# Altium project digital_host_for_ADS1216.PrjPCB
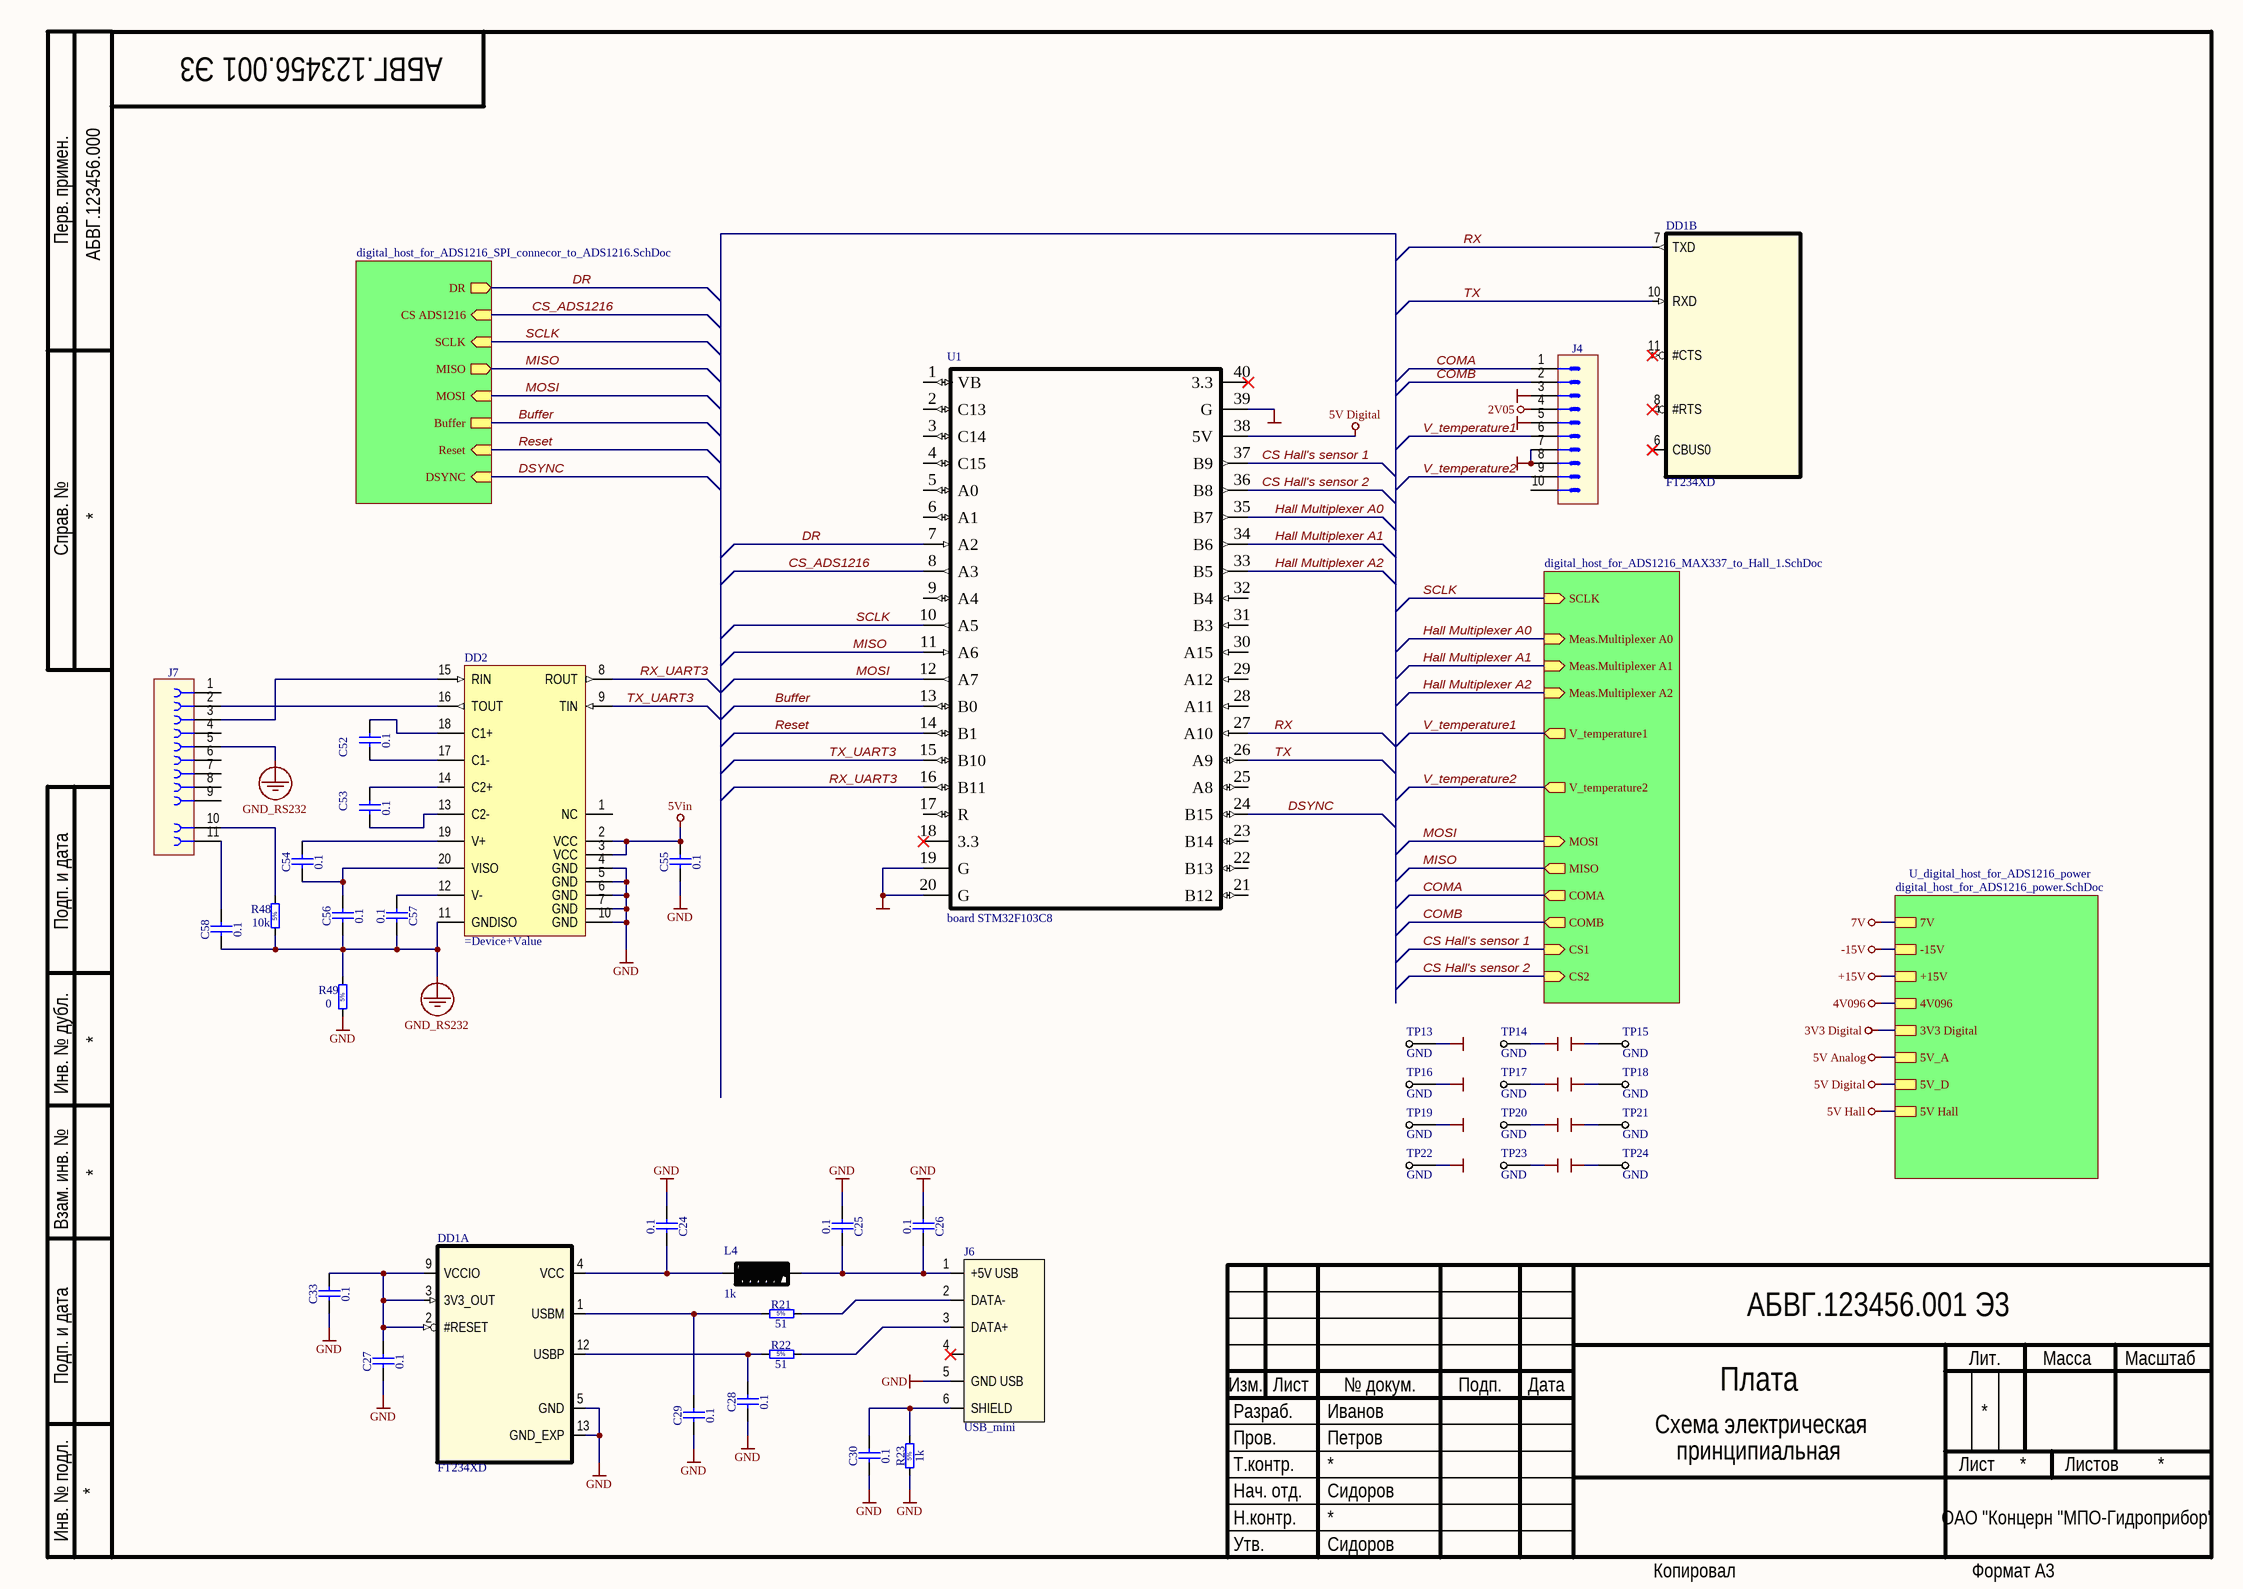
[diagram p0: digital_host_for_ADS1216_main.SchDoc]
3 sheets, 136 parts. Net scope: hierarchical (ports join the sheet entries above them; power ports are global).
Board file: mainboard3.PcbDoc
Sheets:
  digital_host_for_ADS1216_main.SchDoc
    connector to SPI ADS = digital_host_for_ADS1216_SPI_connecor_to_ADS1216.SchDoc
    U_digital_host_for_ADS1216_power = digital_host_for_ADS1216_power.SchDoc

## Sheet digital_host_for_ADS1216_main.SchDoc
size 420 x 297 mm; Address1: Address1; Address2: Address2; Address3: Address3; Address4: Address4; SheetNumber: 1; Scale: 1:1; Разраб.: Иванов; Обозначение документа: АБВГ.123456.001 Э3; Пров.: Петров; Утв.: Сидоров; Наименование организации: ОАО "Концерн "МПО-Гидроприбор"; Перв. применение: АБВГ.123456.000; Наименование изделия 1: Плата; Наименование изделия 2: Схема электрическая; Наименование изделия 3: принципиальная; Нач. отд.: Нач. отд.; Фамилия нач. отд.: Сидоров

### Parts
C24  0.1  [CAPC2012X90N]
C25  0.1  [CAPC2012X90N]
C26  0.1  [CAPC2012X90N]
C27  0.1  [CAPC2012X90N]
C28  0.1  [CAPC2012X90N]
C29  0.1  [CAPC2012X90N]
C30  0.1  [CAPC2012X90N]
C33  0.1  [CAPC2012X90N]
C52  0.1  [CAPC2012X90N]
C53  0.1  [CAPC2012X90N]
C54  0.1  [CAPC2012X90N]
C55  0.1  [CAPC2012X90N]
C56  0.1  [CAPC2012X90N]
C57  0.1  [CAPC2012X90N]
C58  0.1  [CAPC2012X90N]
DD1  FT234XD  [DFN_12-045]  (parts A,B of 2)
DD2  (no value)  [SOIC127P1032X265-20N]
J4  (no value)  [3M_N2510-6002RB]
J6  USB_mini  [TYCO_1734035-1]
J7  (no value)  [TYCO_5747844-5]
L4  1k  [RESC2012X50N]
R21  51  [RESC2012X70N]
R22  51  [RESC2012X70N]
R23  1k  [RESC2012X70N]
R48  10k  [RESC2012X70N]
R49  0  [RESC2012X70N]
TP13  GND  [TP1]
TP14  GND  [TP1]
TP15  GND  [TP1]
TP16  GND  [TP1]
TP17  GND  [TP1]
TP18  GND  [TP1]
TP19  GND  [TP1]
TP20  GND  [TP1]
TP21  GND  [TP1]
TP22  GND  [TP1]
TP23  GND  [TP1]
TP24  GND  [TP1]
U1  board STM32F103C8  [blue_pill]

### Sub-sheets
connector to SPI ADS = digital_host_for_ADS1216_SPI_connecor_to_ADS1216.SchDoc: DR (out), CS ADS1216 (in), SCLK (in), MISO (out), MOSI (in), Buffer, Reset (in), DSYNC (in)
multiplexer = digital_host_for_ADS1216_MAX337_to_Hall_1.SchDoc (file not in this document): Meas.Multiplexer A0 (in), Meas.Multiplexer A1 (in), Meas.Multiplexer A2 (in), COMA (out), COMB (out), V_temperature1 (out), V_temperature2 (out), MOSI (in), MISO (out), CS1 (in), CS2 (in), SCLK (in)
U_digital_host_for_ADS1216_power = digital_host_for_ADS1216_power.SchDoc: 7V, -15V, +15V, 4V096, 3V3 Digital, 5V_A, 5V_D, 5V Hall

### Nets
2V05: J4.4
5V Digital: U1.38(5V) ; sheet U_digital_host_for_ADS1216_power/5V_D
5Vin: C55.1 DD2.2(VCC) DD2.3(VCC)
GND: C24.1 C25.1 C26.1 C27.1 C28.1 C29.1 C30.1 C33.1 C55.2 DD1.5(GND) DD1.13(GND_EXP) DD2.4(GND) DD2.5(GND) DD2.6(GND) DD2.7(GND) DD2.10(GND) J4.3 J4.5 J4.7 J4.8 J6.5(GND_USB) R23.1 R49.1 TP13.1(P) TP14.1(P) TP15.1(P) TP16.1(P) TP17.1(P) TP18.1(P) TP19.1(P) TP20.1(P) TP21.1(P) TP22.1(P) TP23.1(P) TP24.1(P) U1.19(G) U1.20(G) U1.39(G)
GND_RS232: C56.2 C57.1 C58.2 DD2.11(GNDISO) J7.5 R48.1 R49.2
Buffer: U1.13(B0) ; sheet connector to SPI ADS/Buffer
COMA: J4.1 ; sheet multiplexer/COMA
COMB: J4.2 ; sheet multiplexer/COMB
CS Hall's sensor 1: U1.37(B9) ; sheet multiplexer/CS1
CS Hall's sensor 2: U1.36(B8) ; sheet multiplexer/CS2
CS_ADS1216: U1.8(A3) ; sheet connector to SPI ADS/CS ADS1216
DR: U1.7(A2) ; sheet connector to SPI ADS/DR
DSYNC: U1.24(B15) ; sheet connector to SPI ADS/DSYNC
Hall Multiplexer A0: U1.35(B7) ; sheet multiplexer/Meas.Multiplexer A0
Hall Multiplexer A1: U1.34(B6) ; sheet multiplexer/Meas.Multiplexer A1
Hall Multiplexer A2: U1.33(B5) ; sheet multiplexer/Meas.Multiplexer A2
MISO: U1.11(A6) ; sheet connector to SPI ADS/MISO, sheet multiplexer/MISO
MOSI: U1.12(A7) ; sheet connector to SPI ADS/MOSI, sheet multiplexer/MOSI
Reset: U1.14(B1) ; sheet connector to SPI ADS/Reset
RX: DD1.7(TXD) U1.27(A10)
RX_UART3: DD2.8(ROUT) U1.16(B11)
SCLK: U1.10(A5) ; sheet connector to SPI ADS/SCLK, sheet multiplexer/SCLK
TX: DD1.10(RXD) U1.26(A9)
TX_UART3: DD2.9(TIN) U1.15(B10)
V_temperature1: J4.6 ; sheet multiplexer/V_temperature1
V_temperature2: J4.9 ; sheet multiplexer/V_temperature2
NetC24_2: C24.2 DD1.4(VCC) L4.1
NetC25_2: C25.2 C26.2 J6.1(+5V_USB) L4.2
NetC27_2: C27.2 C33.2 DD1.2(#RESET) DD1.3(3V3_OUT) DD1.9(VCCIO)
NetC28_2: C28.2 DD1.12(USBP) R22.1
NetC29_2: C29.2 DD1.1(USBM) R21.1
NetC30_2: C30.2 J6.6(SHIELD) R23.2
NetC52_1: C52.1 DD2.18(C1+)
NetC52_2: C52.2 DD2.17(C1-)
NetC53_1: C53.1 DD2.14(C2+)
NetC53_2: C53.2 DD2.13(C2-)
NetC54_1: C54.1 DD2.19(V+)
NetC54_2: C54.2 C56.1 DD2.20(VISO)
NetC57_2: C57.2 DD2.12(V-)
NetC58_1: C58.1 J7.11
NetDD2_15: DD2.15(RIN) J7.3
NetDD2_16: DD2.16(TOUT) J7.2
NetJ6_2: J6.2(DATA-) R21.2
NetJ6_3: J6.3(DATA+) R22.2
NetJ7_10: J7.10 R48.2

Not connected (* = marked no-connect by the designer): DD1 6(CBUS0)* 8(#RTS)* 11(#CTS)*; DD2 1(NC); J4 10; J6 4*; J7 1 4 6 7 8 9; U1 1(VB) 2(C13) 3(C14) 4(C15) 5(A0) 6(A1) 9(A4) 17(R) 18(3.3)* 21(B12) 22(B13) 23(B14) 25(A8) 28(A11) 29(A12) 30(A15) 31(B3) 32(B4) 40(3.3)*

### Notes on the sheet
- Перв. примен.
- Справ. №
- Подп. и дата
- Инв. № дубл.
- Взам. инв. №
- Разраб.
- Изм.
- Лист
- № докум.
- Подп.
- Дата
- Лит.
- Масса
- Масштаб
- Пров.
- Т.контр.
- Листов
- Инв. № подл.
- Утв.
- Н.контр.
- Копировал
- Формат А3

### Library data of the parts
C24-C30 C33 C52-C58 = Capacitor - non polarized: Non-polarised capacitor2012; SolderOption: 0; SMD Solders: 2; Dielectric type: X5R; Vendor: any; Value: 0.1; THD Solders: 0
DD1 = FT234XD: USB-UART driver; Vendor: FTDI; SMD Solders: 7; THD Solders: 0; Device: FT234XD; Package: DFN_12-0.45; Unit Price: 2
DD2 = ADM3251: Driver UART-RS232; Vendor: Analog Devices; SMD Solder: 20; THD Solder: 0; Unit_Price: 1200; Device: ADM3251; Unit Price: 6; Package: SOICW20; SolderOption: 0
J4 = Connector 10 Male: THD Solders: 10; SMD Solders: 0; Solder Option: *; Value: *; Vendor: *
J6 = USB_mini: Вилка  PLS 6x2.54; Vendor: TE Connectivity; SolderOption: Norm; Price: 50; Value: USB_mini
J7 = Connector 9 Female: Solder Option: 0; THD Solders: 11; SMD Solders: 0; Vendor: *; Value: *
L4 = BLM21: SMD Ferrite bead 0805; Vendor: Vishay; Unit Price: 0.1; Device: BLM21; Package: SMD0805; Value: 1k
R21 R22 R48 = Resistor - 5%: Vendor: any; SMD Solders: 2; THD Solders: 0; TK: 100ppmC^(-1); SolderOption: 0; Tolerance: 5%
  R21 R22: Value: 51
  R48: Value: 10k
R23 = Resistor - 5%: Vendor: any; SMD Solders: 2; THD Solders: 0; TK: 1000ppmC^(-1); Value: 1k; SolderOption: 0; Tolerance: 5%
R49 = Resistor - 5%: Vendor: any; SMD Solders: 2; TK: 100ppmC^(-1); THD Solders: 0; Value: 0; SolderOption: 0; Tolerance: 5%
TP13-TP24 = TP: Контрольная точка; Vendor: PCB; Price: 0; Value: GND; SolderOption: PCB
U1 = Blue Pill: Blue Pill board; Vendor: STM; Pkg: DIP40; SMD Solders: 0; THD Solders: 40; Value: STM32; SolderOption: 0

## Sheet digital_host_for_ADS1216_SPI_connecor_to_ADS1216.SchDoc
size 420 x 297 mm; Address1: Address1; Address2: Address2; Address3: Address3; Address4: Address4; SheetNumber: 1; Scale: 1:1; Разраб.: Иванов; Обозначение документа: АБВГ.123456.001 Э3; Пров.: Петров; Утв.: Сидоров; Наименование организации: ОАО "Концерн "МПО-Гидроприбор"; Перв. применение: АБВГ.123456.000; Наименование изделия 1: Плата; Наименование изделия 2: Схема электрическая; Наименование изделия 3: принципиальная; Нач. отд.: Нач. отд.; Фамилия нач. отд.: Сидоров
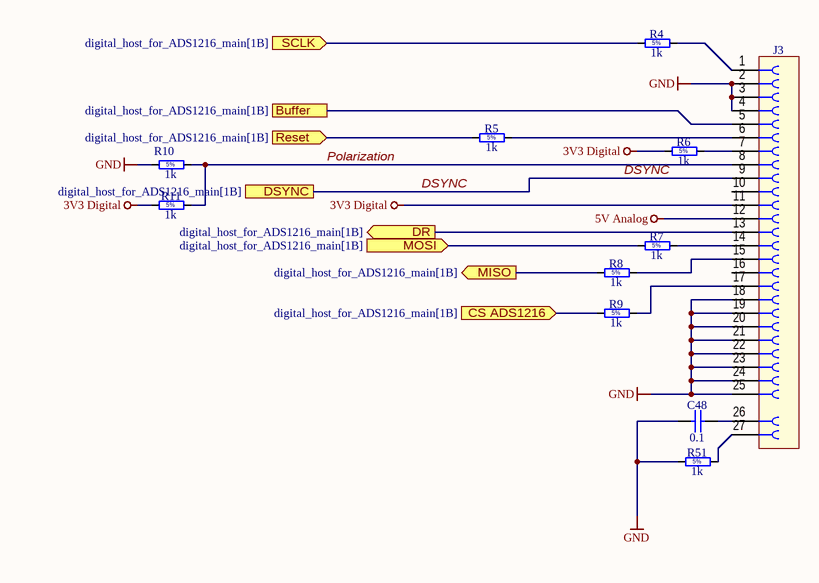
[diagram p1: digital_host_for_ADS1216_SPI_connecor_to_ADS1216.SchDoc]

### Parts
C48  0.1  [CAPC2012X90N]
J3  (no value)  [TYCO_3-1634586-2]
R4  1k  [RESC2012X70N]
R5  1k  [RESC2012X70N]
R6  1k  [RESC2012X70N]
R7  1k  [RESC2012X70N]
R8  1k  [RESC2012X70N]
R9  1k  [RESC2012X70N]
R10  1k  [RESC2012X70N]
R11  1k  [RESC2012X70N]
R51  1k  [RESC2012X70N]

### Ports
Buffer (see digital_host_for_ADS1216_main[1B]), CS ADS1216 (in, see digital_host_for_ADS1216_main[1B]), DR (out, see digital_host_for_ADS1216_main[1B]), DSYNC (see digital_host_for_ADS1216_main[1B]), MISO (out, see digital_host_for_ADS1216_main[1B]), MOSI (in, see digital_host_for_ADS1216_main[1B]), Reset (in, see digital_host_for_ADS1216_main[1B]), SCLK (in, see digital_host_for_ADS1216_main[1B])

### Nets
3V3 Digital: J3.11 R6.1 R11.2
5V Analog: J3.12
GND: C48.1 J3.2 J3.3 J3.4 J3.18 J3.19 J3.20 J3.21 J3.22 J3.23 J3.24 J3.25 R10.2 R51.1
Buffer: J3.5 ; port Buffer
CS_ADS1216: R9.1 ; port CS ADS1216
DR: J3.13 ; port DR
DSYNC: J3.9 ; port DSYNC
MISO: R8.1 ; port MISO
MOSI: R7.1 ; port MOSI
Polarization: J3.8 R10.1 R11.1
Reset: R5.1 ; port Reset
SCLK: R4.1 ; port SCLK
NetC48_2: C48.2 J3.26
NetJ3_1: J3.1 R4.2
NetJ3_6: J3.6 R5.2
NetJ3_7: J3.7 R6.2
NetJ3_14: J3.14 R7.2
NetJ3_15: J3.15 R8.2
NetJ3_17: J3.17 R9.2
NetJ3_27: J3.27 R51.2

Not connected (* = marked no-connect by the designer): J3 10 16

### Notes on the sheet
- Перв. примен.
- Справ. №
- Подп. и дата
- Инв. № дубл.
- Взам. инв. №
- Разраб.
- Изм.
- Лист
- № докум.
- Подп.
- Дата
- Лит.
- Масса
- Масштаб
- Пров.
- Т.контр.
- Листов
- Инв. № подл.
- Утв.
- Н.контр.
- Копировал
- Формат А3

### Library data of the parts
C48 = Capacitor - non polarized: as C24 on sheet digital_host_for_ADS1216_main; Value: 0.1; THD Solders: 0
J3 = Connector 25 Female: Solder Option: 0; THD Solders: 25; SMD Solders: 0; Vendor: *; Value: *
R4-R11 R51 = Resistor - 5%: as R23 on sheet digital_host_for_ADS1216_main; Value: 1k; SolderOption: 0; Tolerance: 5%

## Sheet digital_host_for_ADS1216_power.SchDoc
size 420 x 297 mm; Address1: Address1; Address2: Address2; Address3: Address3; Address4: Address4; SheetNumber: 1; Scale: 1:1; Разраб.: Иванов; Обозначение документа: АБВГ.123456.001 Э3; Пров.: Петров; Утв.: Сидоров; Наименование организации: ОАО "Концерн "МПО-Гидроприбор"; Перв. применение: АБВГ.123456.000; Наименование изделия 1: Плата; Наименование изделия 2: Схема электрическая; Наименование изделия 3: принципиальная; Нач. отд.: Нач. отд.; Фамилия нач. отд.: Сидоров
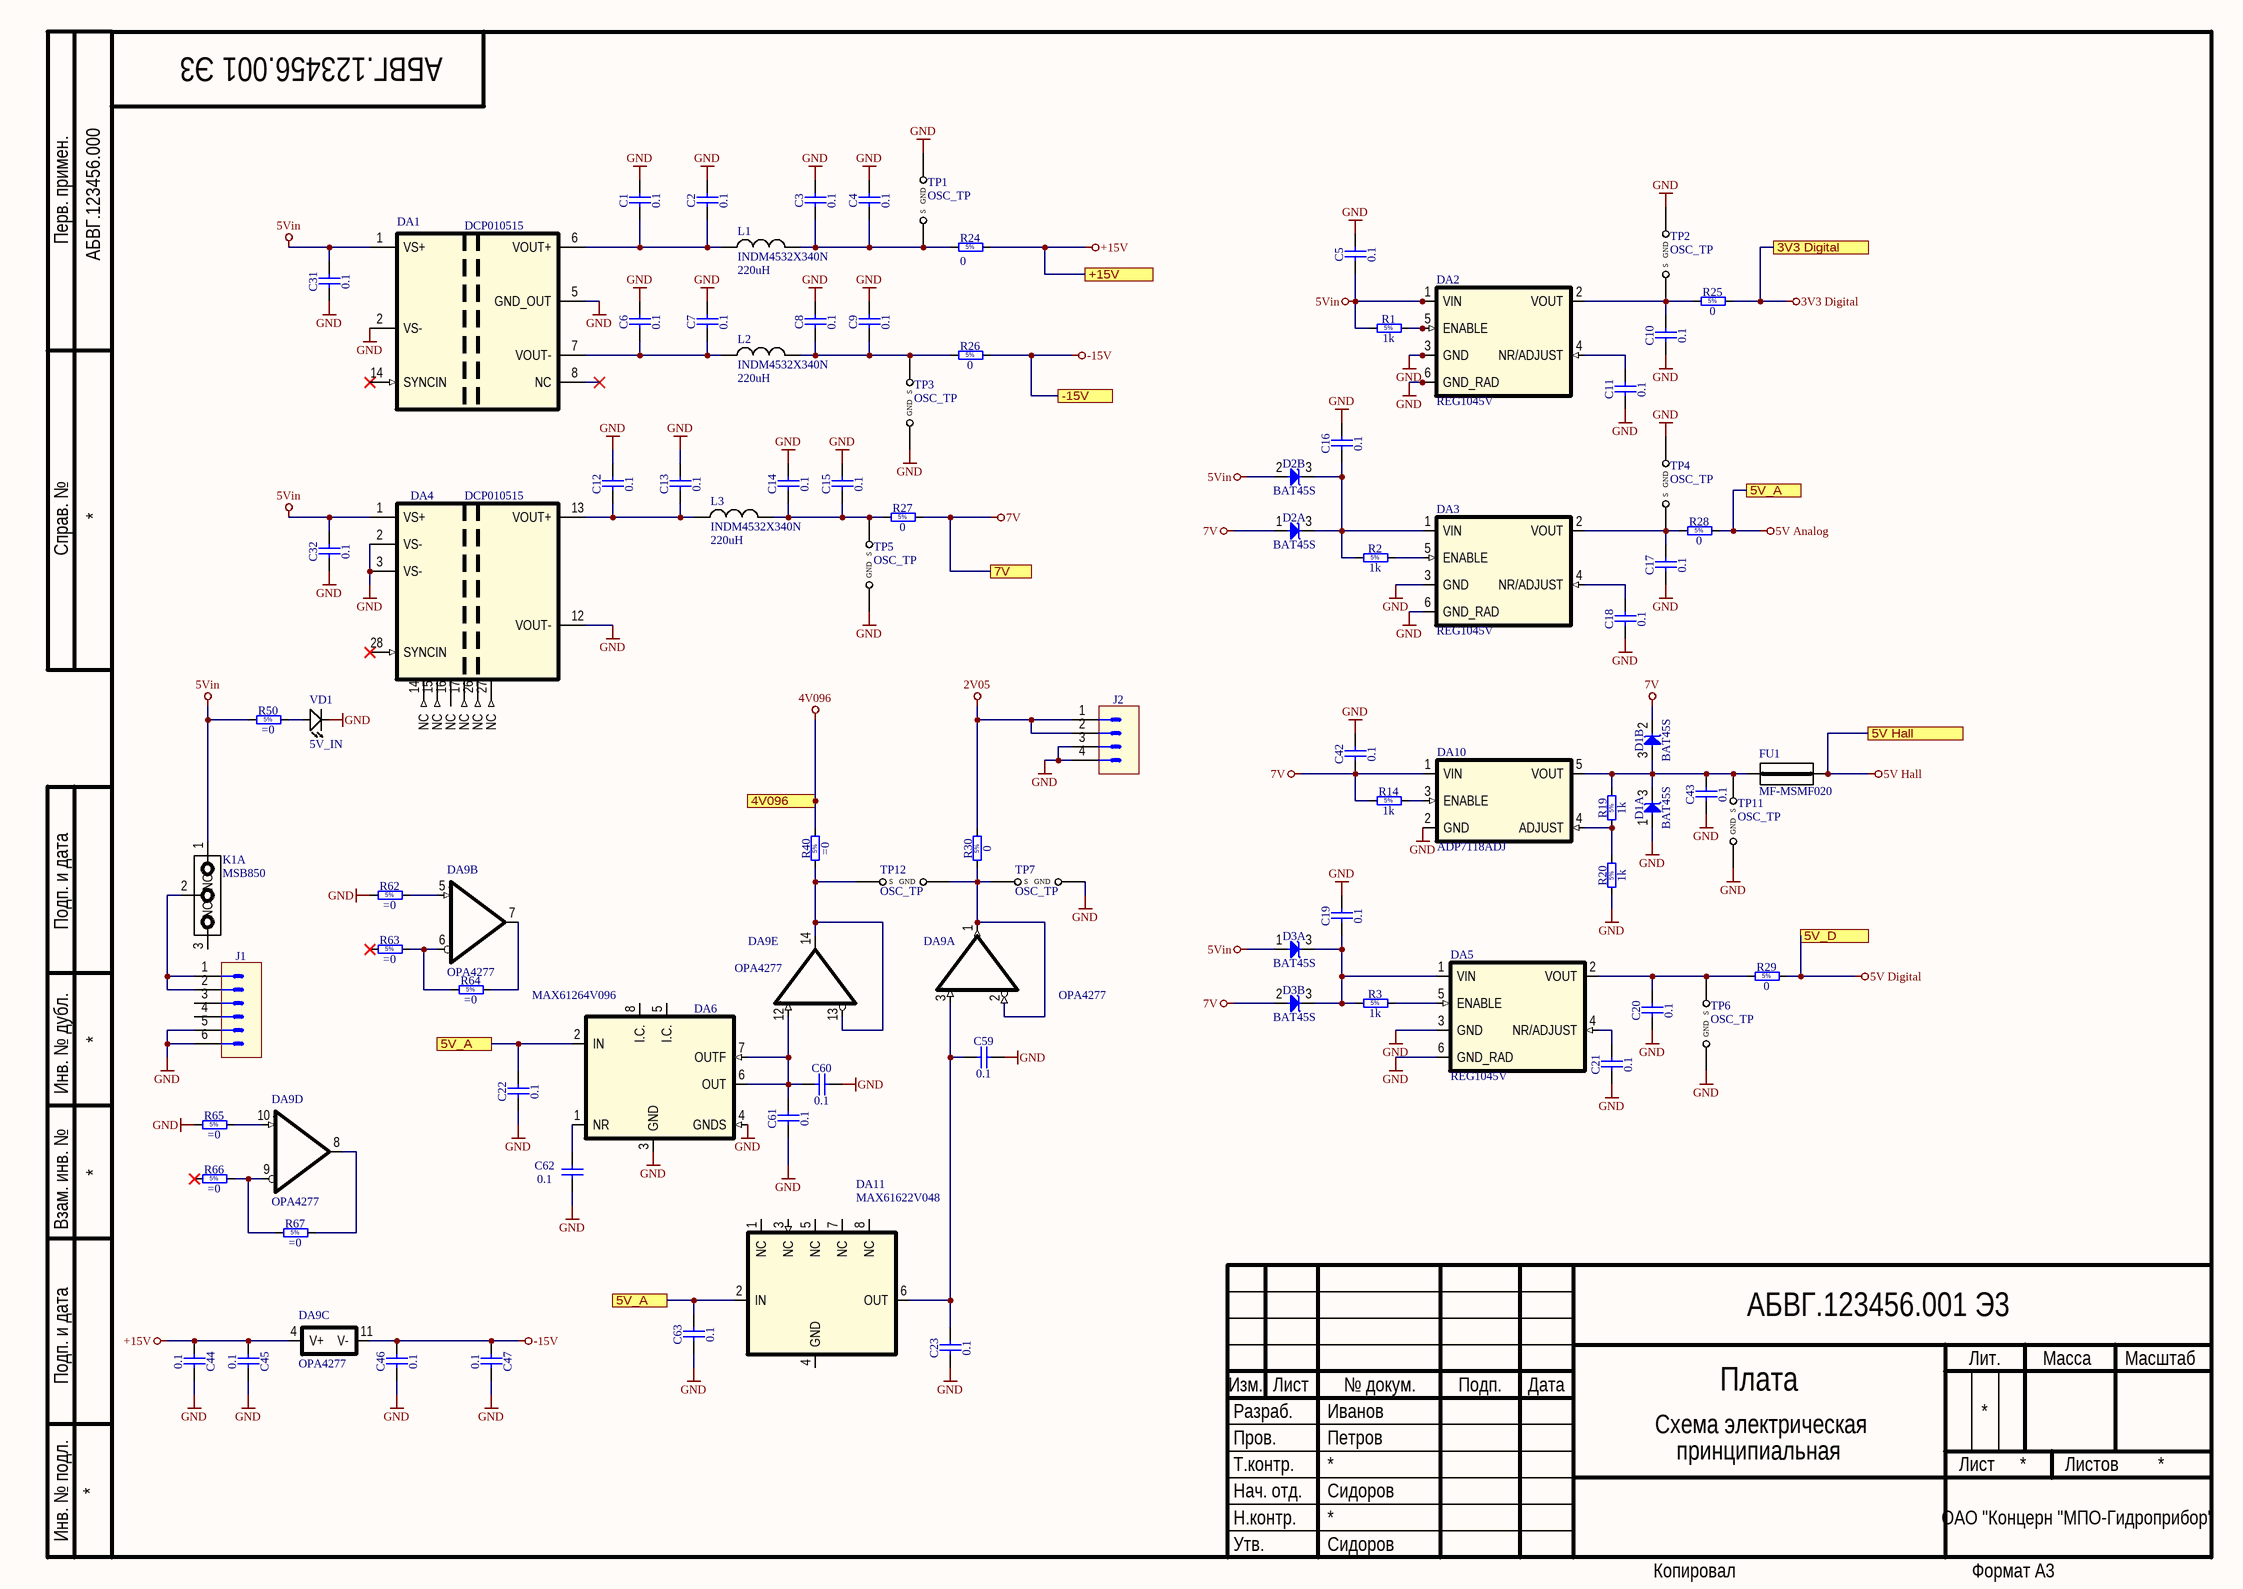
[diagram p2: digital_host_for_ADS1216_power.SchDoc]

### Parts
C1  0.1  [CAPC2012X90N]
C2  0.1  [CAPC2012X90N]
C3  0.1  [CAPC2012X90N]
C4  0.1  [CAPC2012X90N]
C5  0.1  [CAPC2012X90N]
C6  0.1  [CAPC2012X90N]
C7  0.1  [CAPC2012X90N]
C8  0.1  [CAPC2012X90N]
C9  0.1  [CAPC2012X90N]
C10  0.1  [CAPC2012X90N]
C11  0.1  [CAPC2012X90N]
C12  0.1  [CAPC2012X90N]
C13  0.1  [CAPC2012X90N]
C14  0.1  [CAPC2012X90N]
C15  0.1  [CAPC2012X90N]
C16  0.1  [CAPC2012X90N]
C17  0.1  [CAPC2012X90N]
C18  0.1  [CAPC2012X90N]
C19  0.1  [CAPC2012X90N]
C20  0.1  [CAPC2012X90N]
C21  0.1  [CAPC2012X90N]
C22  0.1  [CAPC2012X90N]
C23  0.1  [CAPC2012X90N]
C31  0.1  [CAPC2012X90N]
C32  0.1  [CAPC2012X90N]
C42  0.1  [CAPC2012X90N]
C43  0.1  [CAPC2012X90N]
C44  0.1  [CAPC2012X90N]
C45  0.1  [CAPC2012X90N]
C46  0.1  [CAPC2012X90N]
C47  0.1  [CAPC2012X90N]
C59  0.1  [CAPC2012X90N]
C60  0.1  [CAPC2012X90N]
C61  0.1  [CAPC2012X90N]
C62  0.1  [CAPC2012X90N]
C63  0.1  [CAPC2012X90N]
D1  BAT45S  [SOT-23]  (parts A,B of 2)
D2  BAT45S  [SOT-23]  (parts A,B of 2)
D3  BAT45S  [SOT-23]  (parts A,B of 2)
DA1  DCP010515  [NVA7]
DA2  REG1045V  [SOT223_6-127]
DA3  REG1045V  [SOT223_6-127]
DA4  DCP010515  [SOIC127P1033X265-12_28N]
DA5  REG1045V  [SOT223_6-127]
DA6  MAX61264V096  [SO8]
DA9  OPA4277  [SOIC14]  (parts A,B,C,D,E of 5)
DA10  ADP7118ADJ  [SOT95P270X145-5N]
DA11  MAX61622V048  [SO8]
FU1  MF-MSMF020  [MSMF020]
J1  (no value)  [MOLEX_22-27-2061]
J2  (no value)  [MOLEX_22-27-2041]
K1  MSB850  [MSB850]  (part A of 2)
L1  INDM4532X340N  Inductance: 220uH  [INDM4532X340N]
L2  INDM4532X340N  Inductance: 220uH  [INDM4532X340N]
L3  INDM4532X340N  Inductance: 220uH  [INDM4532X340N]
R1  1k  [RESC2012X70N]
R2  1k  [RESC2012X70N]
R3  1k  [RESC2012X70N]
R14  1k  [RESC2012X70N]
R19  1k  [RESC2012X70N]
R20  1k  [RESC2012X70N]
R24  0  [RESC2012X70N]
R25  0  [RESC2012X70N]
R26  0  [RESC2012X70N]
R27  0  [RESC2012X70N]
R28  0  [RESC2012X70N]
R29  0  [RESC2012X70N]
R30  0  [RESC2012X70N]
R40  (no value)  [RESC2012X70N]
R50  (no value)  [RESC2012X70N]
R62  (no value)  [RESC2012X70N]
R63  (no value)  [RESC2012X70N]
R64  (no value)  [RESC2012X70N]
R65  (no value)  [RESC2012X70N]
R66  (no value)  [RESC2012X70N]
R67  (no value)  [RESC2012X70N]
TP1  OSC_TP  [TP2]
TP2  OSC_TP  [TP2]
TP3  OSC_TP  [TP2]
TP4  OSC_TP  [TP2]
TP5  OSC_TP  [TP2]
TP6  OSC_TP  [TP2]
TP7  OSC_TP  [TP2]
TP11  OSC_TP  [TP2]
TP12  OSC_TP  [TP2]
VD1  5V_IN  [LED0603]

### Ports
3V3 Digital, 4V096, 5V Hall, 5V_A, 5V_D, 7V, +15V, -15V

### Nets
2V05: J2.1 J2.2 R30.2
3V3 Digital: R25.2 ; port 3V3 Digital
4V096: R40.2 ; port 4V096
5V Analog: C22.2 C63.2 DA6.2(IN) DA11.2(IN) R28.2 ; port 5V_A
5V Digital: R29.2 ; port 5V_D
5V Hall: FU1.2 ; port 5V Hall
5Vin: C5.1 C31.2 C32.2 D2.2(A) D3.1(A) DA1.1(VS+) DA2.1(VIN) DA4.1(VS+) K1.1(NO) R1.1 R50.2
7V: C42.1 D1.2(COMAC) D2.1(A) D3.2(A) DA10.1(VIN) R14.1 R27.2 ; port 7V
+15V: C44.1 C45.1 DA9.4(V+) R24.2 ; port +15V
-15V: C46.2 C47.1 DA9.11(V-) R26.2 ; port -15V
GND: C1.2 C2.2 C3.2 C4.2 C5.2 C6.2 C7.2 C8.2 C9.2 C10.1 C11.1 C12.2 C13.2 C14.2 C15.2 C16.2 C17.1 C18.1 C19.2 C20.1 C21.1 C22.1 C23.1 C31.1 C32.1 C42.2 C43.1 C44.2 C45.2 C46.1 C47.2 C59.2 C60.2 C61.1 C62.1 C63.1 D1.1(A) DA1.2(VS-) DA1.5(GND_OUT) DA2.3(GND) DA2.6(GND_RAD) DA3.3(GND) DA3.6(GND_RAD) DA4.2(VS-) DA4.3(VS-) DA4.12(VOUT-) DA5.3(GND) DA5.6(GND_RAD) DA6.3(GND) DA6.4(GNDS) DA10.2(GND) J1.5 J1.6 J2.3 J2.4 R20.1 R62.1 R65.1 TP1.2(GND) TP2.2(GND) TP3.2(GND) TP4.2(GND) TP5.2(GND) TP6.2(GND) TP7.2(GND) TP11.2(GND) VD1.1(Cathode)
NetC1_1: C1.1 C2.1 DA1.6(VOUT+) L1.1
NetC3_1: C3.1 C4.1 L1.2 R24.1 TP1.1(S)
NetC6_1: C6.1 C7.1 DA1.7(VOUT-) L2.1
NetC8_1: C8.1 C9.1 L2.2 R26.1 TP3.1(S)
NetC10_2: C10.2 DA2.2(VOUT) R25.1 TP2.1(S)
NetC11_2: C11.2 DA2.4(NR/ADJUST)
NetC12_1: C12.1 C13.1 DA4.13(VOUT+) L3.1
NetC14_1: C14.1 C15.1 L3.2 R27.1 TP5.1(S)
NetC16_1: C16.1 D2.3(COMAC) DA3.1(VIN) R2.1
NetC17_2: C17.2 DA3.2(VOUT) R28.1 TP4.1(S)
NetC18_2: C18.2 DA3.4(NR/ADJUST)
NetC19_1: C19.1 D3.3(COMAC) DA5.1(VIN) R3.1
NetC20_2: C20.2 DA5.2(VOUT) R29.1 TP6.1(S)
NetC21_2: C21.2 DA5.4(NR/ADJUST)
NetC23_2: C23.2 C59.1 DA9.3(+) DA11.6(OUT)
NetC43_2: C43.2 D1.3(COMAC) DA10.5(VOUT) FU1.1 R19.2 TP11.1(S)
NetC60_1: C60.1 C61.2 DA6.6(OUT) DA6.7(OUTF) DA9.12(+)
NetC62_2: C62.2 DA6.1(NR)
NetDA2_5: DA2.5(ENABLE) R1.2
NetDA3_5: DA3.5(ENABLE) R2.2
NetDA5_5: DA5.5(ENABLE) R3.2
NetDA9_1: DA9.1(OUT) DA9.2(-) R30.1 TP7.1(S) TP12.2(GND)
NetDA9_5: DA9.5(+) R62.2
NetDA9_6: DA9.6(-) R63.2 R64.1
NetDA9_7: DA9.7(OUT) R64.2
NetDA9_8: DA9.8(OUT) R67.2
NetDA9_9: DA9.9(-) R66.2 R67.1
NetDA9_10: DA9.10(+) R65.2
NetDA9_13: DA9.13(-) DA9.14(OUT) R40.1 TP12.1(S)
NetDA10_3: DA10.3(ENABLE) R14.2
NetDA10_4: DA10.4(ADJUST) R19.1 R20.2
NetJ1_1: J1.1 J1.2 K1.2(Cetnter)
NetR50_1: R50.1 VD1.2(Anode)

Not connected (* = marked no-connect by the designer): DA1 8(NC)* 14(SYNCIN)*; DA4 14(NC) 15(NC) 16(NC) 17(NC) 26(NC) 27(NC) 28(SYNCIN)*; DA6 5(I.C.) 8(I.C.); DA11 1(NC) 3(NC) 4(GND) 5(NC) 7(NC) 8(NC); J1 3 4; K1 3(NC); R63 1*; R66 1*

### Notes on the sheet
- Перв. примен.
- Справ. №
- Подп. и дата
- Инв. № дубл.
- Взам. инв. №
- Разраб.
- Изм.
- Лист
- № докум.
- Подп.
- Дата
- Лит.
- Масса
- Масштаб
- Пров.
- Т.контр.
- Листов
- Инв. № подл.
- Утв.
- Н.контр.
- Копировал
- Формат А3

### Library data of the parts
C1-C23 C31 C32 C42-C47 C59-C63 = Capacitor - non polarized: as C24 on sheet digital_host_for_ADS1216_main; Value: 0.1; THD Solders: 0
D1 = BAT54S: Serial Shottky Diode; SMD Solders: 3; THD Sollders: 0; Vendor: NXP; Unut Price: 10; Device: BAT45S; Package: SOT23
D2 D3 = BAT54C: Common Cathode 2 Shottky Diode; SMD Solders: 3; THD Sollders: 0; Vendor: NXP; Unut Price: 10; Device: BAT45S; Package: SOT23
DA1 = DCP020515: DC/DC 5V to isolated +-15V; Vendor: Texas Instruments; Copyright: Copyright (C) 2022 Ultra Librarian. All rights reserved.; Value: DCP010515; Price: 1000
DA2 = REG104_5V: Positive LDO Linear stabilizer 5Vin to 3V3Digital; Vendor: Texas Instruments; Device: REG104; Value: 5V; SMD Solder: 6; THD Solder: 0; Unit Price: 6; Package: SOT223-6; SolderOption: 0
DA3 = REG104_5V: Positive LDO Linear stabilizer 7V to 5V Analog; Vendor: Texas Instruments; Device: REG104; SMD Solder: 6; THD Solder: 0; Unit Price: 6; Package: SOT223-6; Value: 5V; SolderOption: 0
DA4 = DCP020507U: DC/DC 5V to isolated +-7V; Vendor: Texas Instruments; Copyright: Copyright (C) 2022 Ultra Librarian. All rights reserved.; Value: DCP010515; Price: 1000
DA5 = REG104_5V: Positive LDO Linear stabilizer 7V to 5V Digital; Vendor: Texas Instruments; Device: REG104; SMD Solder: 6; THD Solder: 0; Unit Price: 6; Package: SOT223-6; Value: 5V; SolderOption: 0
DA6 = MAX6126: Positive LDO Linear stabilizer; Vendor: Maxim; Value: 4V096; SMD Solder: 8; THD Solder: 0; Device: MAX6126; Unit Price: 2000; Package: SOIC_8; SolderOption: 0
DA9 = OPA4277: счетверённый ОУ; Vendor: Texas Instruments; Voltage: 3..30V/+-1.5..+-15V; Bandwidth: 1.3MHz; SolderOption: Norm; Value: OPA4277
DA10 = ADP7118: Positive LDO Linear stabilizer; Vendor: Analog Devoces; Value: ADJ; SMD Solder: 5; THD Solder: 0; Device: ADP7118; Unit Price: 100; Package: SOT23-5; SolderOption: 0
DA11 = MAX6162: Reference LDO Linear stabilizer; Vendor: Maxim; Value: 2V048; SMD Solder: 8; THD Solder: 0; Device: MAX6162; Unit Price: 2000; Package: SOIC_8; SolderOption: 0
FU1 = MF-MSMF: Предохранитель самовосстанавливающийся; Vendor: Bourns; SolderOption: Norm; Price: 20; Value: MF-MSMF020
J1 = WF6: Connector 4 Male; THD Solders: 4; SMD Solders: 0; Vendor: Molex; Value: WF6; SolderOption: 0
J2 = WF4: Connector 4 Male; THD Solders: 4; SMD Solders: 0; Vendor: Molex; Value: WF4; SolderOption: 0
K1 = MSB850: Кнопка с фиксацией 2xSPDT; SolderOption: Norm; Price: 1; Vendor: *; Value: MSB850
L1-L3 = INDM4532X340N: SMD Дроссель; Vendor: Sumida; Curent: 0.5A; Price: 100; Value: INDM4532X340N
R1-R3 R14 R19 R20 = Resistor - 5%: as R23 on sheet digital_host_for_ADS1216_main; Value: 1k; SolderOption: 0; Tolerance: 5%
R24-R30 = Resistor - 5%: Vendor: any; SMD Solders: 2; SolderOption: NP; TK: 1000ppmC^(-1); THD Solders: 0; Value: 0; Tolerance: 5%
R40 R50 R62-R67 = Resistor - 5%: Vendor: any; SMD Solders: 2; THD Solders: 0; Value: 1k; TK: 1000ppmC^(-1); SolderOption: 0; Tolerance: 5%
TP1-TP7 TP11 TP12 = OscTP: Контрольная точка для подключения осциллографа короткой землёй; Vendor: PCB; Price: 0; Value: OSC_TP; SolderOption: PCB
VD1 = LED0603: Чип светодиод 0603; Vendor: KB; Color: Green; SolderOpton: Norm; Price: 20; Value: 5V_IN

## Nets that join several sheets
2V05: digital_host_for_ADS1216_main (J4.4), digital_host_for_ADS1216_power (J2.1 J2.2 R30.2)
3V3 Digital: digital_host_for_ADS1216_SPI_connecor_to_ADS1216 (J3.11 R6.1 R11.2), digital_host_for_ADS1216_power (R25.2)
5V Analog: digital_host_for_ADS1216_SPI_connecor_to_ADS1216 (J3.12), digital_host_for_ADS1216_power (5 pins)
5V Digital: digital_host_for_ADS1216_main (U1.38), digital_host_for_ADS1216_power (R29.2)
5Vin: digital_host_for_ADS1216_main (C55.1 DD2.2 DD2.3), digital_host_for_ADS1216_power (11 pins)
GND: digital_host_for_ADS1216_main (38 pins), digital_host_for_ADS1216_SPI_connecor_to_ADS1216 (14 pins), digital_host_for_ADS1216_power (67 pins)
Buffer: digital_host_for_ADS1216_main (U1.13), digital_host_for_ADS1216_SPI_connecor_to_ADS1216 (J3.5)
CS_ADS1216: digital_host_for_ADS1216_main (U1.8), digital_host_for_ADS1216_SPI_connecor_to_ADS1216 (R9.1)
DR: digital_host_for_ADS1216_main (U1.7), digital_host_for_ADS1216_SPI_connecor_to_ADS1216 (J3.13)
DSYNC: digital_host_for_ADS1216_main (U1.24), digital_host_for_ADS1216_SPI_connecor_to_ADS1216 (J3.9)
MISO: digital_host_for_ADS1216_main (U1.11), digital_host_for_ADS1216_SPI_connecor_to_ADS1216 (R8.1)
MOSI: digital_host_for_ADS1216_main (U1.12), digital_host_for_ADS1216_SPI_connecor_to_ADS1216 (R7.1)
Reset: digital_host_for_ADS1216_main (U1.14), digital_host_for_ADS1216_SPI_connecor_to_ADS1216 (R5.1)
SCLK: digital_host_for_ADS1216_main (U1.10), digital_host_for_ADS1216_SPI_connecor_to_ADS1216 (R4.1)